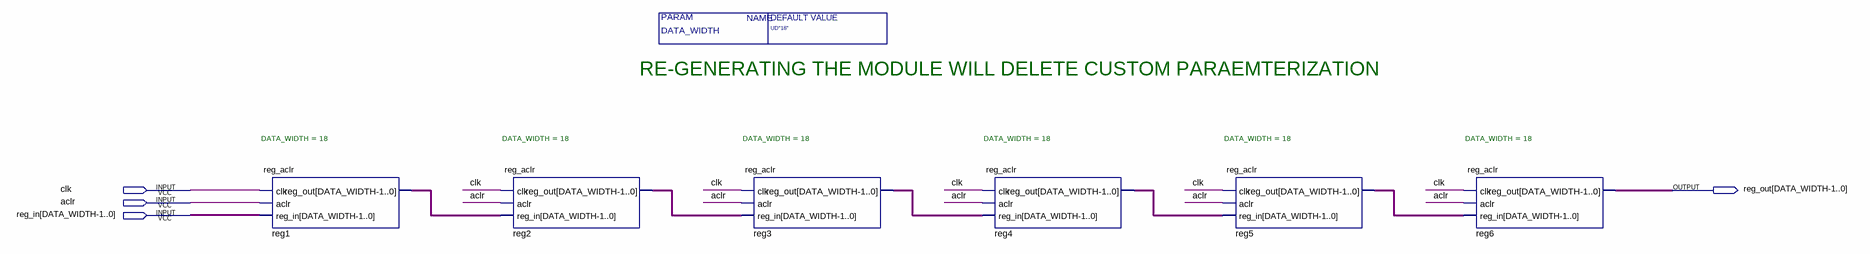
[diagram p0: schematic sheet]
// Quartus schematic reg_delay_6L_aclr.bdf as structural Verilog: 6 symbols, 4 pins
module reg_delay_6L_aclr #(parameter DATA_WIDTH = "UD\"18\"") (
  input  clk,
  input  aclr,
  input  \reg_in[DATA_WIDTH-1..0] ,
  output \reg_out[DATA_WIDTH-1..0] 
);

  wire [17:0] reg1_reg_out, reg2_reg_out, reg3_reg_out, reg4_reg_out, reg5_reg_out, reg6_reg_out, undriven;

  reg_aclr #(.DATA_WIDTH(18)) reg1 (.clk(clk), .aclr(aclr), .reg_in(undriven), .reg_out(reg1_reg_out));
  reg_aclr #(.DATA_WIDTH(18)) reg2 (.clk(clk), .aclr(aclr), .reg_in(reg1_reg_out), .reg_out(reg2_reg_out));
  reg_aclr #(.DATA_WIDTH(18)) reg3 (.clk(clk), .aclr(aclr), .reg_in(reg2_reg_out), .reg_out(reg3_reg_out));
  reg_aclr #(.DATA_WIDTH(18)) reg4 (.clk(clk), .aclr(aclr), .reg_in(reg3_reg_out), .reg_out(reg4_reg_out));
  reg_aclr #(.DATA_WIDTH(18)) reg5 (.clk(clk), .aclr(aclr), .reg_in(reg4_reg_out), .reg_out(reg5_reg_out));
  reg_aclr #(.DATA_WIDTH(18)) reg6 (.clk(clk), .aclr(aclr), .reg_in(reg5_reg_out), .reg_out(reg6_reg_out));

  // Notes on the sheet:
  //   RE-GENERATING THE MODULE WILL DELETE CUSTOM PARAEMTERIZATION
endmodule
